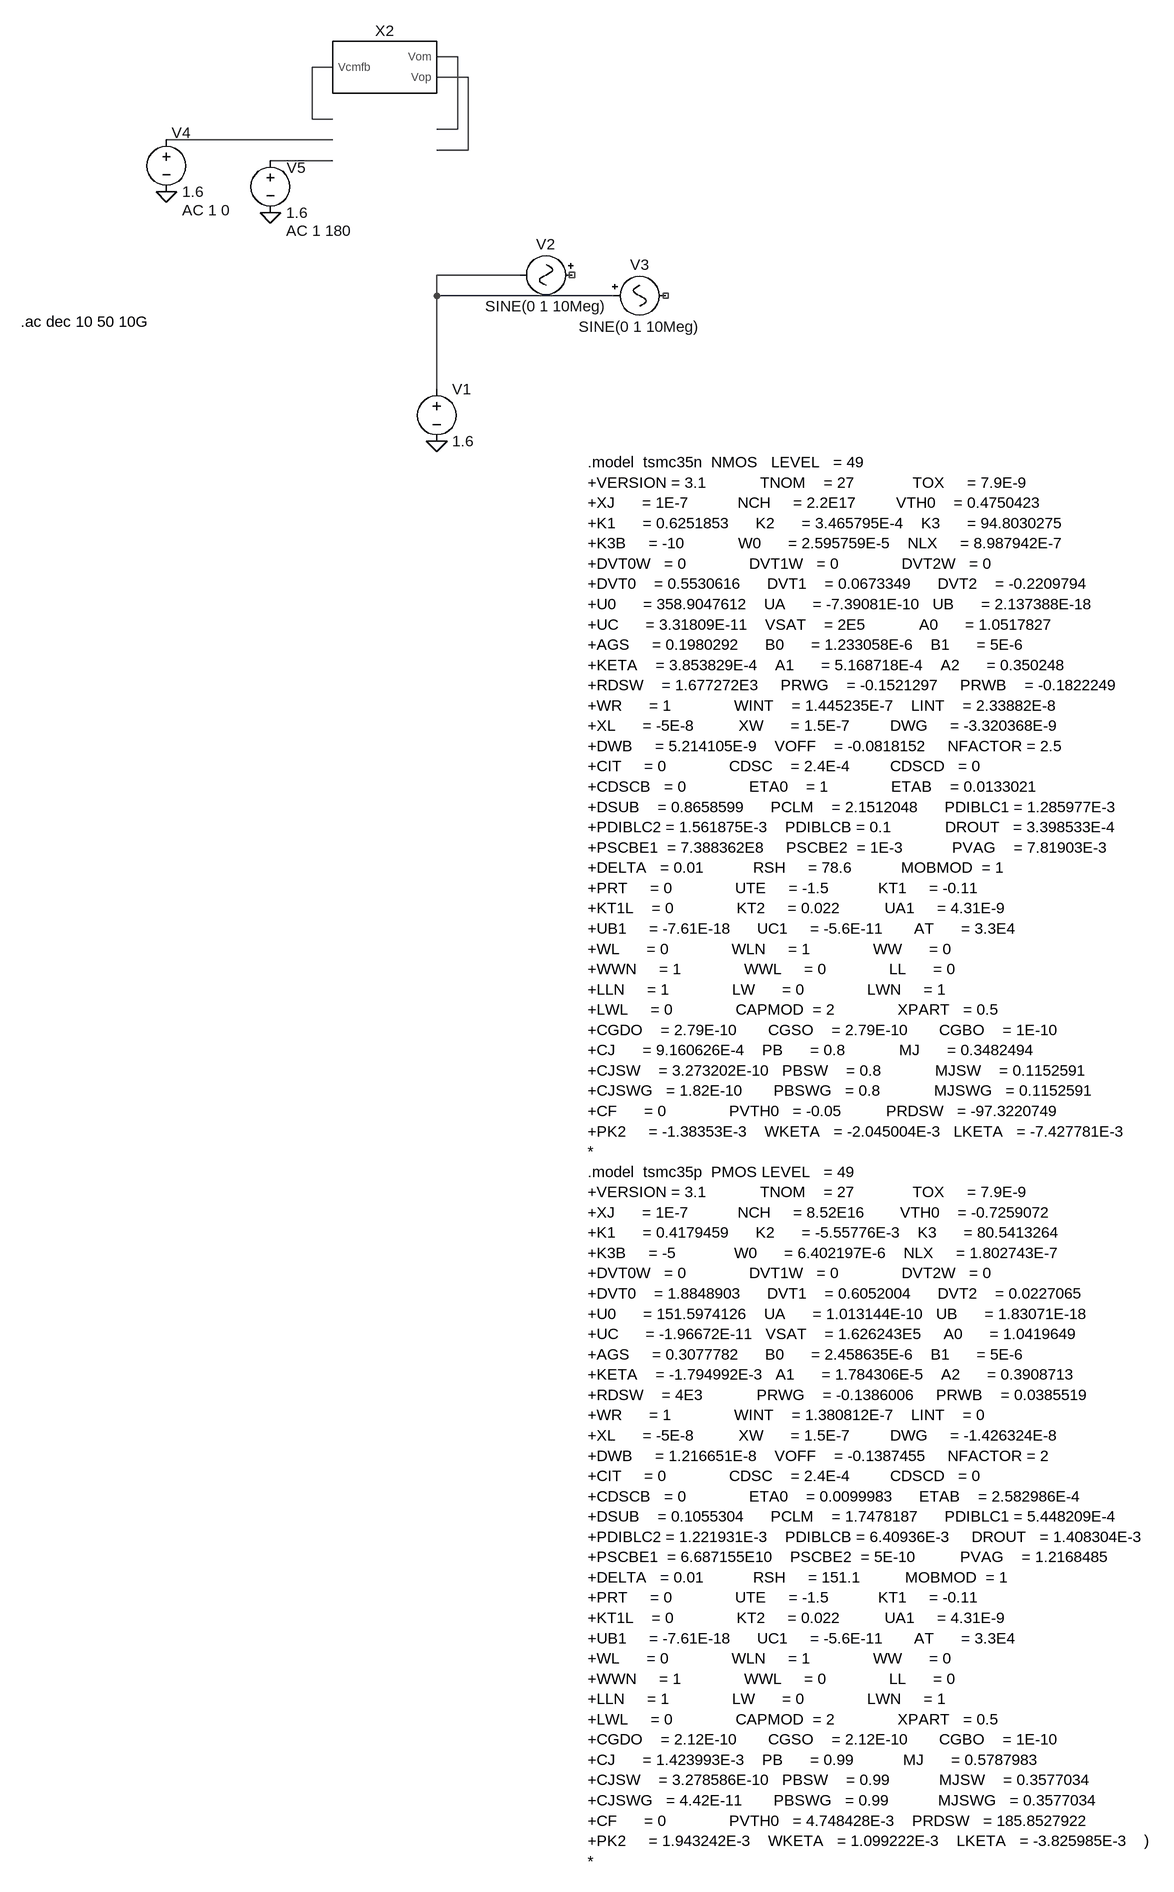
[diagram p0: schematic Draft9.asc]
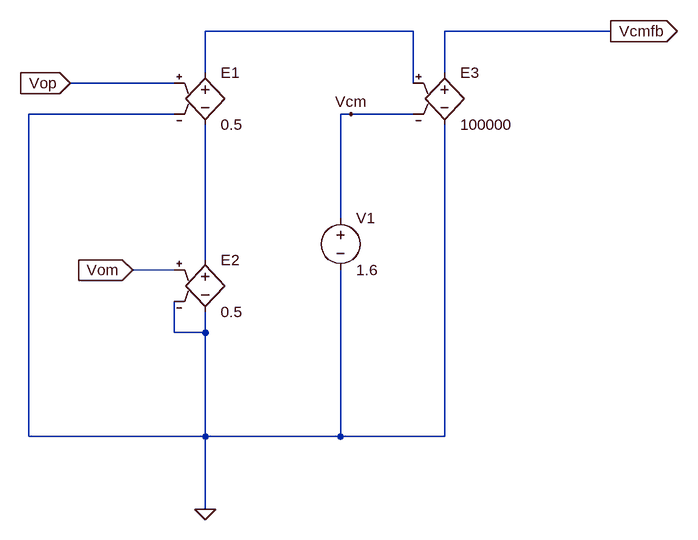
[diagram p1: sub-circuit cmfb.asc]
Draft9.asc, the LTspice schematic file:
Version 4
SHEET 1 1448 2588
WIRE 320 16 288 16
WIRE 128 32 96 32
WIRE 336 48 288 48
WIRE 96 112 96 32
WIRE 128 112 96 112
WIRE 320 128 320 16
WIRE 320 128 288 128
WIRE 128 144 -128 144
WIRE 336 160 336 48
WIRE 336 160 288 160
WIRE 128 176 32 176
WIRE 416 352 288 352
WIRE 288 384 288 352
WIRE 560 384 288 384
WIRE 288 528 288 384
FLAG 288 608 0
FLAG 32 256 0
FLAG -128 224 0
SYMBOL cmfb 208 32 M0
SYMATTR InstName X2
SYMBOL voltage 288 512 R0
WINDOW 123 0 0 Left 0
WINDOW 39 0 0 Left 0
SYMATTR InstName V1
SYMATTR Value 1.6
SYMBOL Misc\\signal 512 352 R90
WINDOW 0 -32 56 VBottom 2
WINDOW 3 32 56 VTop 2
WINDOW 123 0 0 Left 0
WINDOW 39 0 0 Left 0
SYMATTR InstName V2
SYMATTR Value SINE(0 1 10Meg)
SYMBOL Misc\\signal 544 384 M90
WINDOW 0 -32 56 VBottom 2
WINDOW 3 32 56 VTop 2
WINDOW 123 0 0 Left 0
WINDOW 39 0 0 Left 0
SYMATTR InstName V3
SYMATTR Value SINE(0 1 10Meg)
SYMBOL voltage -128 128 R0
WINDOW 123 24 124 Left 2
WINDOW 39 0 0 Left 0
WINDOW 0 8 5 Left 2
SYMATTR Value2 AC 1 0
SYMATTR InstName V4
SYMATTR Value 1.6
SYMBOL voltage 32 160 R0
WINDOW 123 24 124 Left 2
WINDOW 39 0 0 Left 0
WINDOW 0 25 27 Left 2
SYMATTR Value2 AC 1 180
SYMATTR InstName V5
SYMATTR Value 1.6
TEXT -352 424 Left 2 !.ac dec 10 50 10G
TEXT 520 640 Left 2 !.model  tsmc35n  NMOS   LEVEL   = 49\n+VERSION = 3.1            TNOM    = 27             TOX     = 7.9E-9\n+XJ      = 1E-7           NCH     = 2.2E17         VTH0    = 0.4750423\n+K1      = 0.6251853      K2      = 3.465795E-4    K3      = 94.8030275\n+K3B     = -10            W0      = 2.595759E-5    NLX     = 8.987942E-7\n+DVT0W   = 0              DVT1W   = 0              DVT2W   = 0\n+DVT0    = 0.5530616      DVT1    = 0.0673349      DVT2    = -0.2209794\n+U0      = 358.9047612    UA      = -7.39081E-10   UB      = 2.137388E-18\n+UC      = 3.31809E-11    VSAT    = 2E5            A0      = 1.0517827\n+AGS     = 0.1980292      B0      = 1.233058E-6    B1      = 5E-6\n+KETA    = 3.853829E-4    A1      = 5.168718E-4    A2      = 0.350248\n+RDSW    = 1.677272E3     PRWG    = -0.1521297     PRWB    = -0.1822249\n+WR      = 1              WINT    = 1.445235E-7    LINT    = 2.33882E-8\n+XL      = -5E-8          XW      = 1.5E-7         DWG     = -3.320368E-9\n+DWB     = 5.214105E-9    VOFF    = -0.0818152     NFACTOR = 2.5\n+CIT     = 0              CDSC    = 2.4E-4         CDSCD   = 0\n+CDSCB   = 0              ETA0    = 1              ETAB    = 0.0133021\n+DSUB    = 0.8658599      PCLM    = 2.1512048      PDIBLC1 = 1.285977E-3\n+PDIBLC2 = 1.561875E-3    PDIBLCB = 0.1            DROUT   = 3.398533E-4\n+PSCBE1  = 7.388362E8     PSCBE2  = 1E-3           PVAG    = 7.81903E-3\n+DELTA   = 0.01           RSH     = 78.6           MOBMOD  = 1\n+PRT     = 0              UTE     = -1.5           KT1     = -0.11\n+KT1L    = 0              KT2     = 0.022          UA1     = 4.31E-9\n+UB1     = -7.61E-18      UC1     = -5.6E-11       AT      = 3.3E4\n+WL      = 0              WLN     = 1              WW      = 0\n+WWN     = 1              WWL     = 0              LL      = 0\n+LLN     = 1              LW      = 0              LWN     = 1\n+LWL     = 0              CAPMOD  = 2              XPART   = 0.5\n+CGDO    = 2.79E-10       CGSO    = 2.79E-10       CGBO    = 1E-10\n+CJ      = 9.160626E-4    PB      = 0.8            MJ      = 0.3482494\n+CJSW    = 3.273202E-10   PBSW    = 0.8            MJSW    = 0.1152591\n+CJSWG   = 1.82E-10       PBSWG   = 0.8            MJSWG   = 0.1152591\n+CF      = 0              PVTH0   = -0.05          PRDSW   = -97.3220749\n+PK2     = -1.38353E-3    WKETA   = -2.045004E-3   LKETA   = -7.427781E-3    \n*\n.model  tsmc35p  PMOS LEVEL   = 49 \n+VERSION = 3.1            TNOM    = 27             TOX     = 7.9E-9\n+XJ      = 1E-7           NCH     = 8.52E16        VTH0    = -0.7259072\n+K1      = 0.4179459      K2      = -5.55776E-3    K3      = 80.5413264\n+K3B     = -5             W0      = 6.402197E-6    NLX     = 1.802743E-7\n+DVT0W   = 0              DVT1W   = 0              DVT2W   = 0\n+DVT0    = 1.8848903      DVT1    = 0.6052004      DVT2    = 0.0227065\n+U0      = 151.5974126    UA      = 1.013144E-10   UB      = 1.83071E-18\n+UC      = -1.96672E-11   VSAT    = 1.626243E5     A0      = 1.0419649\n+AGS     = 0.3077782      B0      = 2.458635E-6    B1      = 5E-6\n+KETA    = -1.794992E-3   A1      = 1.784306E-5    A2      = 0.3908713\n+RDSW    = 4E3            PRWG    = -0.1386006     PRWB    = 0.0385519\n+WR      = 1              WINT    = 1.380812E-7    LINT    = 0\n+XL      = -5E-8          XW      = 1.5E-7         DWG     = -1.426324E-8\n+DWB     = 1.216651E-8    VOFF    = -0.1387455     NFACTOR = 2\n+CIT     = 0              CDSC    = 2.4E-4         CDSCD   = 0\n+CDSCB   = 0              ETA0    = 0.0099983      ETAB    = 2.582986E-4\n+DSUB    = 0.1055304      PCLM    = 1.7478187      PDIBLC1 = 5.448209E-4\n+PDIBLC2 = 1.221931E-3    PDIBLCB = 6.40936E-3     DROUT   = 1.408304E-3\n+PSCBE1  = 6.687155E10    PSCBE2  = 5E-10          PVAG    = 1.2168485\n+DELTA   = 0.01           RSH     = 151.1          MOBMOD  = 1\n+PRT     = 0              UTE     = -1.5           KT1     = -0.11\n+KT1L    = 0              KT2     = 0.022          UA1     = 4.31E-9\n+UB1     = -7.61E-18      UC1     = -5.6E-11       AT      = 3.3E4\n+WL      = 0              WLN     = 1              WW      = 0\n+WWN     = 1              WWL     = 0              LL      = 0\n+LLN     = 1              LW      = 0              LWN     = 1\n+LWL     = 0              CAPMOD  = 2              XPART   = 0.5\n+CGDO    = 2.12E-10       CGSO    = 2.12E-10       CGBO    = 1E-10\n+CJ      = 1.423993E-3    PB      = 0.99           MJ      = 0.5787983\n+CJSW    = 3.278586E-10   PBSW    = 0.99           MJSW    = 0.3577034\n+CJSWG   = 4.42E-11       PBSWG   = 0.99           MJSWG   = 0.3577034\n+CF      = 0              PVTH0   = 4.748428E-3    PRDSW   = 185.8527922\n+PK2     = 1.943242E-3    WKETA   = 1.099222E-3    LKETA   = -3.825985E-3    )\n*

cmfb.asc, the sub-circuit schematic file:
Version 4
SHEET 1 948 836
WIRE 512 80 192 80
WIRE 816 80 560 80
WIRE 192 144 192 80
WIRE 560 144 560 80
WIRE 144 160 -16 160
WIRE 512 160 512 80
WIRE 144 208 -80 208
WIRE 416 208 400 208
WIRE 512 208 416 208
WIRE 400 368 400 208
WIRE 192 432 192 224
WIRE 144 448 80 448
WIRE 144 544 144 496
WIRE 192 544 192 512
WIRE 192 544 144 544
WIRE -80 704 -80 208
WIRE 192 704 192 544
WIRE 192 704 -80 704
WIRE 400 704 400 448
WIRE 400 704 192 704
WIRE 560 704 560 224
WIRE 560 704 400 704
WIRE 192 816 192 704
FLAG 192 816 0
FLAG 416 208 Vcm
FLAG -16 160 Vop
IOPIN -16 160 In
FLAG 80 448 Vom
IOPIN 80 448 In
FLAG 816 80 Vcmfb
IOPIN 816 80 Out
SYMBOL e 192 128 R0
SYMATTR InstName E1
SYMATTR Value 0.5
SYMBOL e 192 416 R0
SYMATTR InstName E2
SYMATTR Value 0.5
SYMBOL e 560 128 R0
SYMATTR InstName E3
SYMATTR Value 100000
SYMBOL voltage 400 352 R0
WINDOW 123 0 0 Left 0
WINDOW 39 0 0 Left 0
SYMATTR InstName V1
SYMATTR Value 1.6

The netlist it stands for:
* Draft9.asc
XX2 N001 N003 N002 cmfb
V1 N006 0 1.6
V2 NC_01 N006 SINE(0 1 10Meg)
V3 N006 NC_02 SINE(0 1 10Meg)
V4 N004 0 1.6 AC 1 0
V5 N005 0 1.6 AC 1 180

* block symbol definitions
.subckt cmfb Vom Vop Vcmfb
E1 N001 N002 Vop 0 0.5
E2 N002 0 Vom 0 0.5
E3 Vcmfb 0 N001 Vcm 100000
V1 Vcm 0 1.6
.ends cmfb

.ac dec 10 50 10G
.model  tsmc35n  NMOS   LEVEL   = 49
+VERSION = 3.1            TNOM    = 27             TOX     = 7.9E-9
+XJ      = 1E-7           NCH     = 2.2E17         VTH0    = 0.4750423
+K1      = 0.6251853      K2      = 3.465795E-4    K3      = 94.8030275
+K3B     = -10            W0      = 2.595759E-5    NLX     = 8.987942E-7
+DVT0W   = 0              DVT1W   = 0              DVT2W   = 0
+DVT0    = 0.5530616      DVT1    = 0.0673349      DVT2    = -0.2209794
+U0      = 358.9047612    UA      = -7.39081E-10   UB      = 2.137388E-18
+UC      = 3.31809E-11    VSAT    = 2E5            A0      = 1.0517827
+AGS     = 0.1980292      B0      = 1.233058E-6    B1      = 5E-6
+KETA    = 3.853829E-4    A1      = 5.168718E-4    A2      = 0.350248
+RDSW    = 1.677272E3     PRWG    = -0.1521297     PRWB    = -0.1822249
+WR      = 1              WINT    = 1.445235E-7    LINT    = 2.33882E-8
+XL      = -5E-8          XW      = 1.5E-7         DWG     = -3.320368E-9
+DWB     = 5.214105E-9    VOFF    = -0.0818152     NFACTOR = 2.5
+CIT     = 0              CDSC    = 2.4E-4         CDSCD   = 0
+CDSCB   = 0              ETA0    = 1              ETAB    = 0.0133021
+DSUB    = 0.8658599      PCLM    = 2.1512048      PDIBLC1 = 1.285977E-3
+PDIBLC2 = 1.561875E-3    PDIBLCB = 0.1            DROUT   = 3.398533E-4
+PSCBE1  = 7.388362E8     PSCBE2  = 1E-3           PVAG    = 7.81903E-3
+DELTA   = 0.01           RSH     = 78.6           MOBMOD  = 1
+PRT     = 0              UTE     = -1.5           KT1     = -0.11
+KT1L    = 0              KT2     = 0.022          UA1     = 4.31E-9
+UB1     = -7.61E-18      UC1     = -5.6E-11       AT      = 3.3E4
+WL      = 0              WLN     = 1              WW      = 0
+WWN     = 1              WWL     = 0              LL      = 0
+LLN     = 1              LW      = 0              LWN     = 1
+LWL     = 0              CAPMOD  = 2              XPART   = 0.5
+CGDO    = 2.79E-10       CGSO    = 2.79E-10       CGBO    = 1E-10
+CJ      = 9.160626E-4    PB      = 0.8            MJ      = 0.3482494
+CJSW    = 3.273202E-10   PBSW    = 0.8            MJSW    = 0.1152591
+CJSWG   = 1.82E-10       PBSWG   = 0.8            MJSWG   = 0.1152591
+CF      = 0              PVTH0   = -0.05          PRDSW   = -97.3220749
+PK2     = -1.38353E-3    WKETA   = -2.045004E-3   LKETA   = -7.427781E-3
*
.model  tsmc35p  PMOS LEVEL   = 49
+VERSION = 3.1            TNOM    = 27             TOX     = 7.9E-9
+XJ      = 1E-7           NCH     = 8.52E16        VTH0    = -0.7259072
+K1      = 0.4179459      K2      = -5.55776E-3    K3      = 80.5413264
+K3B     = -5             W0      = 6.402197E-6    NLX     = 1.802743E-7
+DVT0W   = 0              DVT1W   = 0              DVT2W   = 0
+DVT0    = 1.8848903      DVT1    = 0.6052004      DVT2    = 0.0227065
+U0      = 151.5974126    UA      = 1.013144E-10   UB      = 1.83071E-18
+UC      = -1.96672E-11   VSAT    = 1.626243E5     A0      = 1.0419649
+AGS     = 0.3077782      B0      = 2.458635E-6    B1      = 5E-6
+KETA    = -1.794992E-3   A1      = 1.784306E-5    A2      = 0.3908713
+RDSW    = 4E3            PRWG    = -0.1386006     PRWB    = 0.0385519
+WR      = 1              WINT    = 1.380812E-7    LINT    = 0
+XL      = -5E-8          XW      = 1.5E-7         DWG     = -1.426324E-8
+DWB     = 1.216651E-8    VOFF    = -0.1387455     NFACTOR = 2
+CIT     = 0              CDSC    = 2.4E-4         CDSCD   = 0
+CDSCB   = 0              ETA0    = 0.0099983      ETAB    = 2.582986E-4
+DSUB    = 0.1055304      PCLM    = 1.7478187      PDIBLC1 = 5.448209E-4
+PDIBLC2 = 1.221931E-3    PDIBLCB = 6.40936E-3     DROUT   = 1.408304E-3
+PSCBE1  = 6.687155E10    PSCBE2  = 5E-10          PVAG    = 1.2168485
+DELTA   = 0.01           RSH     = 151.1          MOBMOD  = 1
+PRT     = 0              UTE     = -1.5           KT1     = -0.11
+KT1L    = 0              KT2     = 0.022          UA1     = 4.31E-9
+UB1     = -7.61E-18      UC1     = -5.6E-11       AT      = 3.3E4
+WL      = 0              WLN     = 1              WW      = 0
+WWN     = 1              WWL     = 0              LL      = 0
+LLN     = 1              LW      = 0              LWN     = 1
+LWL     = 0              CAPMOD  = 2              XPART   = 0.5
+CGDO    = 2.12E-10       CGSO    = 2.12E-10       CGBO    = 1E-10
+CJ      = 1.423993E-3    PB      = 0.99           MJ      = 0.5787983
+CJSW    = 3.278586E-10   PBSW    = 0.99           MJSW    = 0.3577034
+CJSWG   = 4.42E-11       PBSWG   = 0.99           MJSWG   = 0.3577034
+CF      = 0              PVTH0   = 4.748428E-3    PRDSW   = 185.8527922
+PK2     = 1.943242E-3    WKETA   = 1.099222E-3    LKETA   = -3.825985E-3    )
*
.backanno
.end